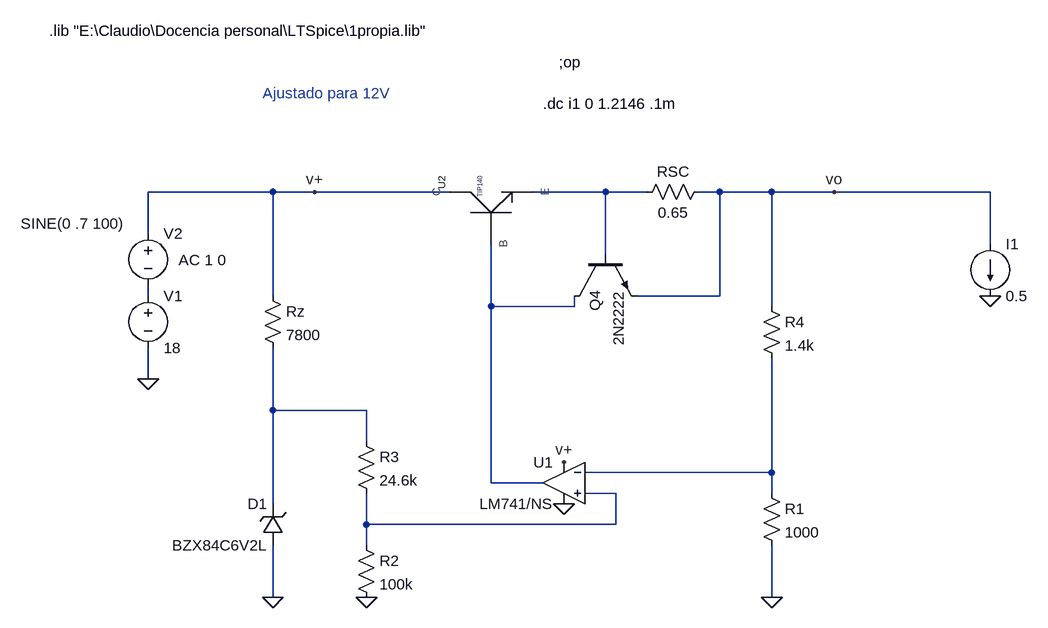
[diagram p0: schematic reguladorx2.asc]
reguladorx2.asc, the LTspice schematic file:
Version 4
SHEET 1 1624 880
WIRE 224 -48 32 -48
WIRE 288 -48 224 -48
WIRE 496 -48 288 -48
WIRE 736 -48 624 -48
WIRE 800 -48 736 -48
WIRE 912 -48 880 -48
WIRE 992 -48 912 -48
WIRE 1088 -48 992 -48
WIRE 1328 -48 1088 -48
WIRE 32 16 32 -48
WIRE 1328 32 1328 -48
WIRE 736 48 736 -48
WIRE 32 112 32 96
WIRE 224 112 224 -48
WIRE 912 112 912 -48
WIRE 912 112 784 112
WIRE 560 128 560 32
WIRE 688 128 688 112
WIRE 688 128 560 128
WIRE 992 128 992 -48
WIRE 32 240 32 192
WIRE 224 288 224 192
WIRE 368 288 224 288
WIRE 368 336 368 288
WIRE 992 384 992 208
WIRE 992 384 704 384
WIRE 560 400 560 128
WIRE 640 400 560 400
WIRE 752 416 704 416
WIRE 992 416 992 384
WIRE 224 432 224 288
WIRE 368 464 368 416
WIRE 752 464 752 416
WIRE 752 464 368 464
WIRE 368 496 368 464
WIRE 224 576 224 496
WIRE 992 576 992 496
FLAG 32 240 0
FLAG 224 576 0
FLAG 992 576 0
FLAG 1088 -48 vo
FLAG 288 -48 v+
FLAG 672 368 v+
FLAG 672 432 0
FLAG 368 576 0
FLAG 1328 112 0
DATAFLAG 992 -48 ""
DATAFLAG 992 304 ""
DATAFLAG 224 304 ""
DATAFLAG 592 240 ""
DATAFLAG 384 -48 ""
DATAFLAG 688 -48 ""
DATAFLAG 1216 -48 ""
DATAFLAG 560 288 ""
DATAFLAG 432 464 ""
SYMBOL voltage 32 96 R0
WINDOW 123 0 0 Left 2
WINDOW 39 0 0 Left 2
SYMATTR InstName V1
SYMATTR Value 18
SYMBOL voltage 32 0 R0
WINDOW 123 47 57 Left 2
WINDOW 39 0 0 Left 2
WINDOW 3 -196 1 Left 2
SYMATTR Value2 AC 1 0
SYMATTR Value SINE(0 .7 100)
SYMATTR InstName V2
SYMBOL res 208 96 R0
SYMATTR InstName Rz
SYMATTR Value 7800
SYMBOL zener 240 496 R180
WINDOW 0 24 64 Left 2
WINDOW 3 24 0 Left 2
SYMATTR InstName D1
SYMATTR Value BZX84C6V2L
SYMATTR Description Diode
SYMATTR Type diode
SYMBOL res 976 400 R0
SYMATTR InstName R1
SYMATTR Value 1000
SYMBOL npn 688 48 M90
SYMATTR InstName Q4
SYMATTR Value 2N2222
SYMBOL res 896 -64 R90
WINDOW 0 0 56 VBottom 2
WINDOW 3 32 56 VTop 2
SYMATTR InstName RSC
SYMATTR Value 0.65
SYMBOL res 352 480 R0
SYMATTR InstName R2
SYMATTR Value 100k
SYMBOL res 352 320 R0
SYMATTR InstName R3
SYMATTR Value 24.6k
SYMBOL res 976 112 R0
SYMATTR InstName R4
SYMATTR Value 1.4k
SYMBOL OpAmps\\opamp2 672 336 M0
SYMATTR InstName U1
SYMATTR Value LM741/NS
SYMBOL Propia\\Darlington\ npn 560 -16 R270
SYMATTR Value TIP140
SYMATTR InstName U2
SYMBOL current 1328 32 R0
WINDOW 123 0 0 Left 0
WINDOW 39 0 0 Left 0
SYMATTR InstName I1
SYMATTR Value 0.5
TEXT 664 -248 Left 2 !;op
TEXT -120 -296 Left 2 !.lib "E:\\Claudio\\Docencia personal\\LTSpice\\1propia.lib"
TEXT 208 -200 Left 2 ;Ajustado para 12V
TEXT 640 -184 Left 2 !.dc i1 0 1.2146 .1m

The netlist it stands for:
* reguladorx2.asc
V1 N002 0 18
V2 v+ N002 SINE(0 .7 100) AC 1 0
Rz v+ N004 7800
D1 0 N004 BZX84C6V2L
R1 N005 0 1000
Q4 N003 N001 vo 0 2N2222
RSC vo N001 0.65
R2 N006 0 100k
R3 N004 N006 24.6k
R4 vo N005 1.4k
XU1 N006 N005 v+ 0 N003 LM741/NS  ; pins In+ In- V+ V- OUT
XU2 v+ N003 N001 TIP140  ; pins C B E
I1 vo 0 0.5
.model D D
.lib standard.dio
.model NPN NPN
.model PNP PNP
.lib standard.bjt
;op
.lib "E:\Claudio\Docencia personal\LTSpice\1propia.lib"
* Ajustado para 12V
.dc i1 0 1.2146 .1m
.backanno
.end